# EAGLE schematic untitled (EAGLE 8.0.2)
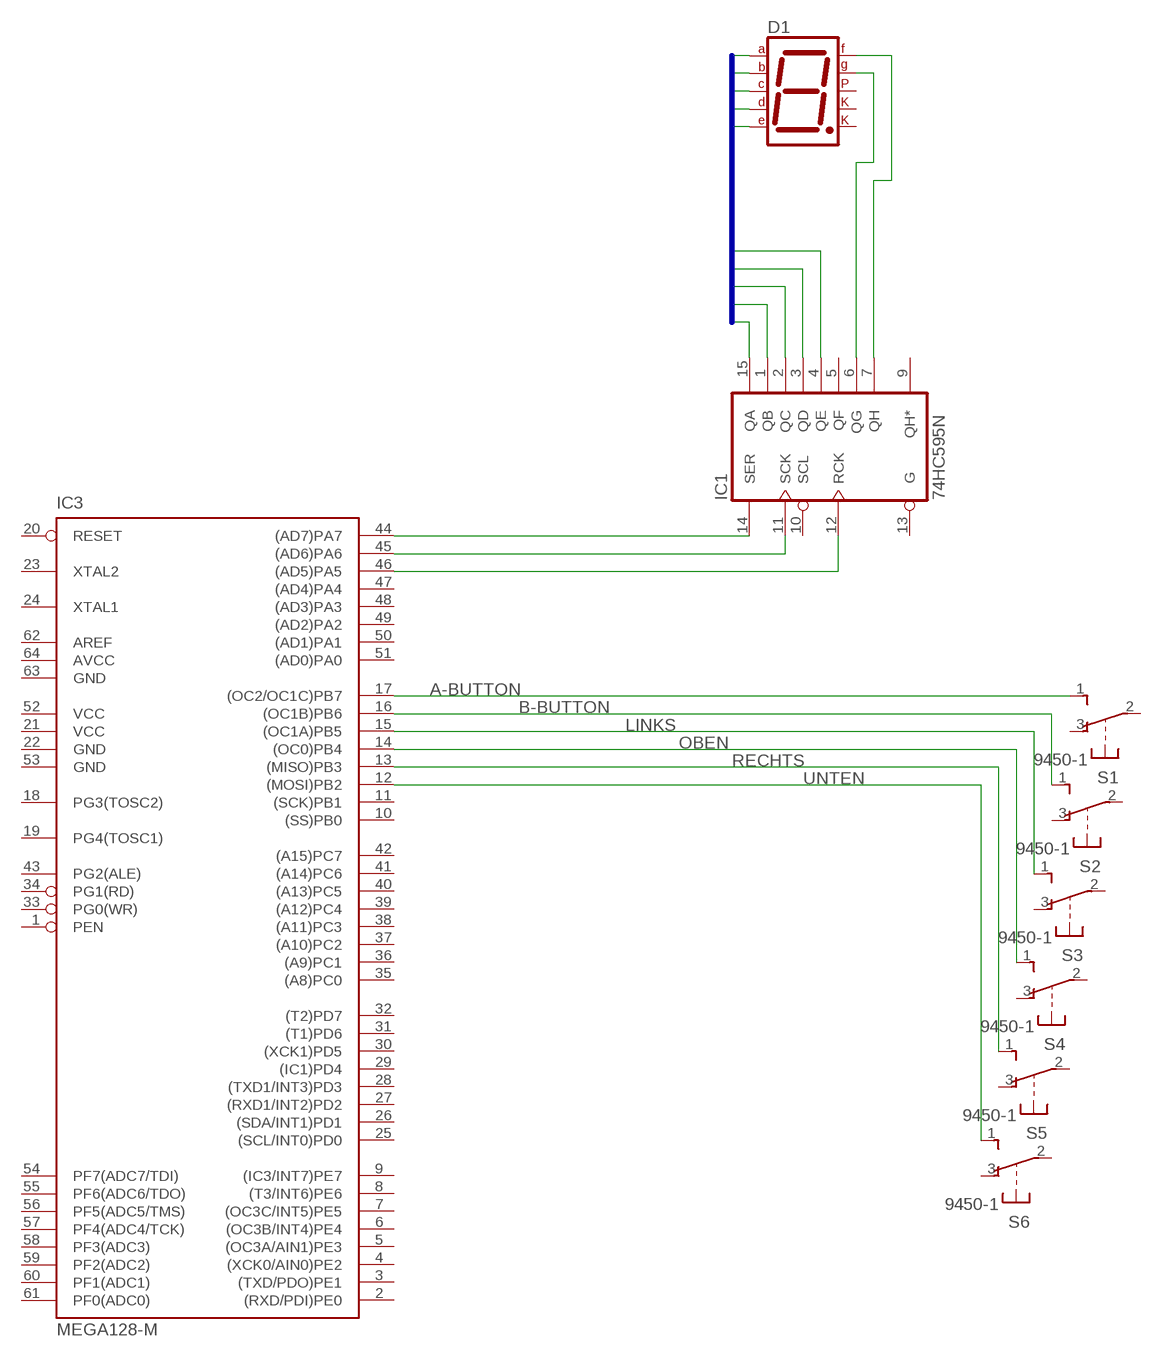
[diagram p0: schematic, sheet 1]

## Parts
D1  7SEG-CK  [7SEG-13]
IC1  74HC595N  [DIL16]
IC3  MEGA128-M  [MLF64]
S1  9450-1  [9450-1]
S2  9450-1  [9450-1]
S3  9450-1  [9450-1]
S4  9450-1  [9450-1]
S5  9450-1  [9450-1]
S6  9450-1  [9450-1]

## Nets
A-BUTTON: IC3.17((OC2/OC1C)PB7) S1.1(S)
B-BUTTON: IC3.16((OC1B)PB6) S2.1(S)
LINKS: IC3.15((OC1A)PB5) S3.1(S)
N$1: IC1.14(SER) IC3.44((AD7)PA7)
N$2: IC1.11(SCK) IC3.45((AD6)PA6)
N$3: IC1.12(RCK) IC3.46((AD5)PA5)
N$4: D1.10(G) IC1.6(QG)
N$5: D1.9(F) IC1.7(QH)
OBEN: IC3.14((OC0)PB4) S4.1(S)
RECHTS: IC3.13((MISO)PB3) S5.1(S)
SEG1: D1.7(A) IC1.15(QA)
SEG2: D1.6(B) IC1.1(QB)
SEG3: D1.4(C) IC1.2(QC)
SEG4: D1.2(D) IC1.3(QD)
SEG5: D1.1(E) IC1.4(QE)
UNTEN: IC3.12((MOSI)PB2) S6.1(S)
Unconnected: D1.3(CK1) D1.5(DP) D1.8(CK2) IC1.5(QF) IC1.9(QH*) IC1.10(SCL) IC1.13(G) IC3.1(PEN) IC3.2((RXD/PDI)PE0) IC3.3((TXD/PDO)PE1) IC3.4((XCK0/AIN0)PE2) IC3.5((OC3A/AIN1)PE3) IC3.6((OC3B/INT4)PE4) IC3.7((OC3C/INT5)PE5) IC3.8((T3/INT6)PE6) IC3.9((IC3/INT7)PE7) IC3.10((SS)PB0) IC3.11((SCK)PB1) IC3.18(PG3(TOSC2)) IC3.19(PG4(TOSC1)) IC3.20(RESET) IC3.23(XTAL2) IC3.24(XTAL1) IC3.25((SCL/INT0)PD0) IC3.26((SDA/INT1)PD1) IC3.27((RXD1/INT2)PD2) IC3.28((TXD1/INT3)PD3) IC3.29((IC1)PD4) IC3.30((XCK1)PD5) IC3.31((T1)PD6) IC3.32((T2)PD7) IC3.33(PG0(WR)) IC3.34(PG1(RD)) IC3.35((A8)PC0) IC3.36((A9)PC1) IC3.37((A10)PC2) IC3.38((A11)PC3) IC3.39((A12)PC4) IC3.40((A13)PC5) IC3.41((A14)PC6) IC3.42((A15)PC7) IC3.43(PG2(ALE)) IC3.47((AD4)PA4) IC3.48((AD3)PA3) IC3.49((AD2)PA2) IC3.50((AD1)PA1) IC3.51((AD0)PA0) IC3.54(PF7(ADC7/TDI)) IC3.55(PF6(ADC6/TDO)) IC3.56(PF5(ADC5/TMS)) IC3.57(PF4(ADC4/TCK)) IC3.58(PF3(ADC3)) IC3.59(PF2(ADC2)) IC3.60(PF1(ADC1)) IC3.61(PF0(ADC0)) IC3.62(AREF) S1.2(P) S1.3(O) S2.2(P) S2.3(O) S3.2(P) S3.3(O) S4.2(P) S4.3(O) S5.2(P) S5.3(O) S6.2(P) S6.3(O)

## Buses
SEG[1..5]

## Power pins joined to a net without a drawn wire
AVCC: IC3.64(AVCC)
GND: IC1.8(GND) IC3.22(GND) IC3.53(GND) IC3.63(GND)
VCC: IC1.16(VCC) IC3.21(VCC) IC3.52(VCC)

## Library data of the parts
D1 = special:7SEG-CK: 7-segment DISPLAY single cathode, 13 mm
IC1 = 74xx-eu:74*595: 8-bit SHIFT REGISTER, output latch
IC3 = atmel:MEGA128: MICROCONTROLLER 128 Kbytes FLASH 4 Kbytes SRAM 4 Kbytes EEPROM DUAL USART 8-channel 10 bit ADC Source: avr.lbr; MPN: ATMEGA128-16MU; OC_FARNELL: 1455093; OC_NEWARK: 58M3717
S1-S6 = switch-misc:9450-1: MARQUARDT SWITCH